# Altium schematic sheet llrf_fmc_ext_male.SchDoc: =GlobalProjectName
size 410 x 297 mm; SheetNumber: 1; SheetTotal: 1; PageSetup: Record=PageOptions|CenterHorizontal=True|CenterVertical=True|PrintScale=1.00|XCorrection=1.00|YCorrection=1.00|PrintKind=1|BorderSize=5000000|LeftOffset=0|BottomOffset=0|Orientation=2|PaperLength=1000|PaperWidth=1000|Scale=100|PaperSource=15|PrintQuality=1200|MediaType=1|DitherType=10|PaperKind=A3|PrintScaleMode=1; Weight: -; ScaleFactor: -
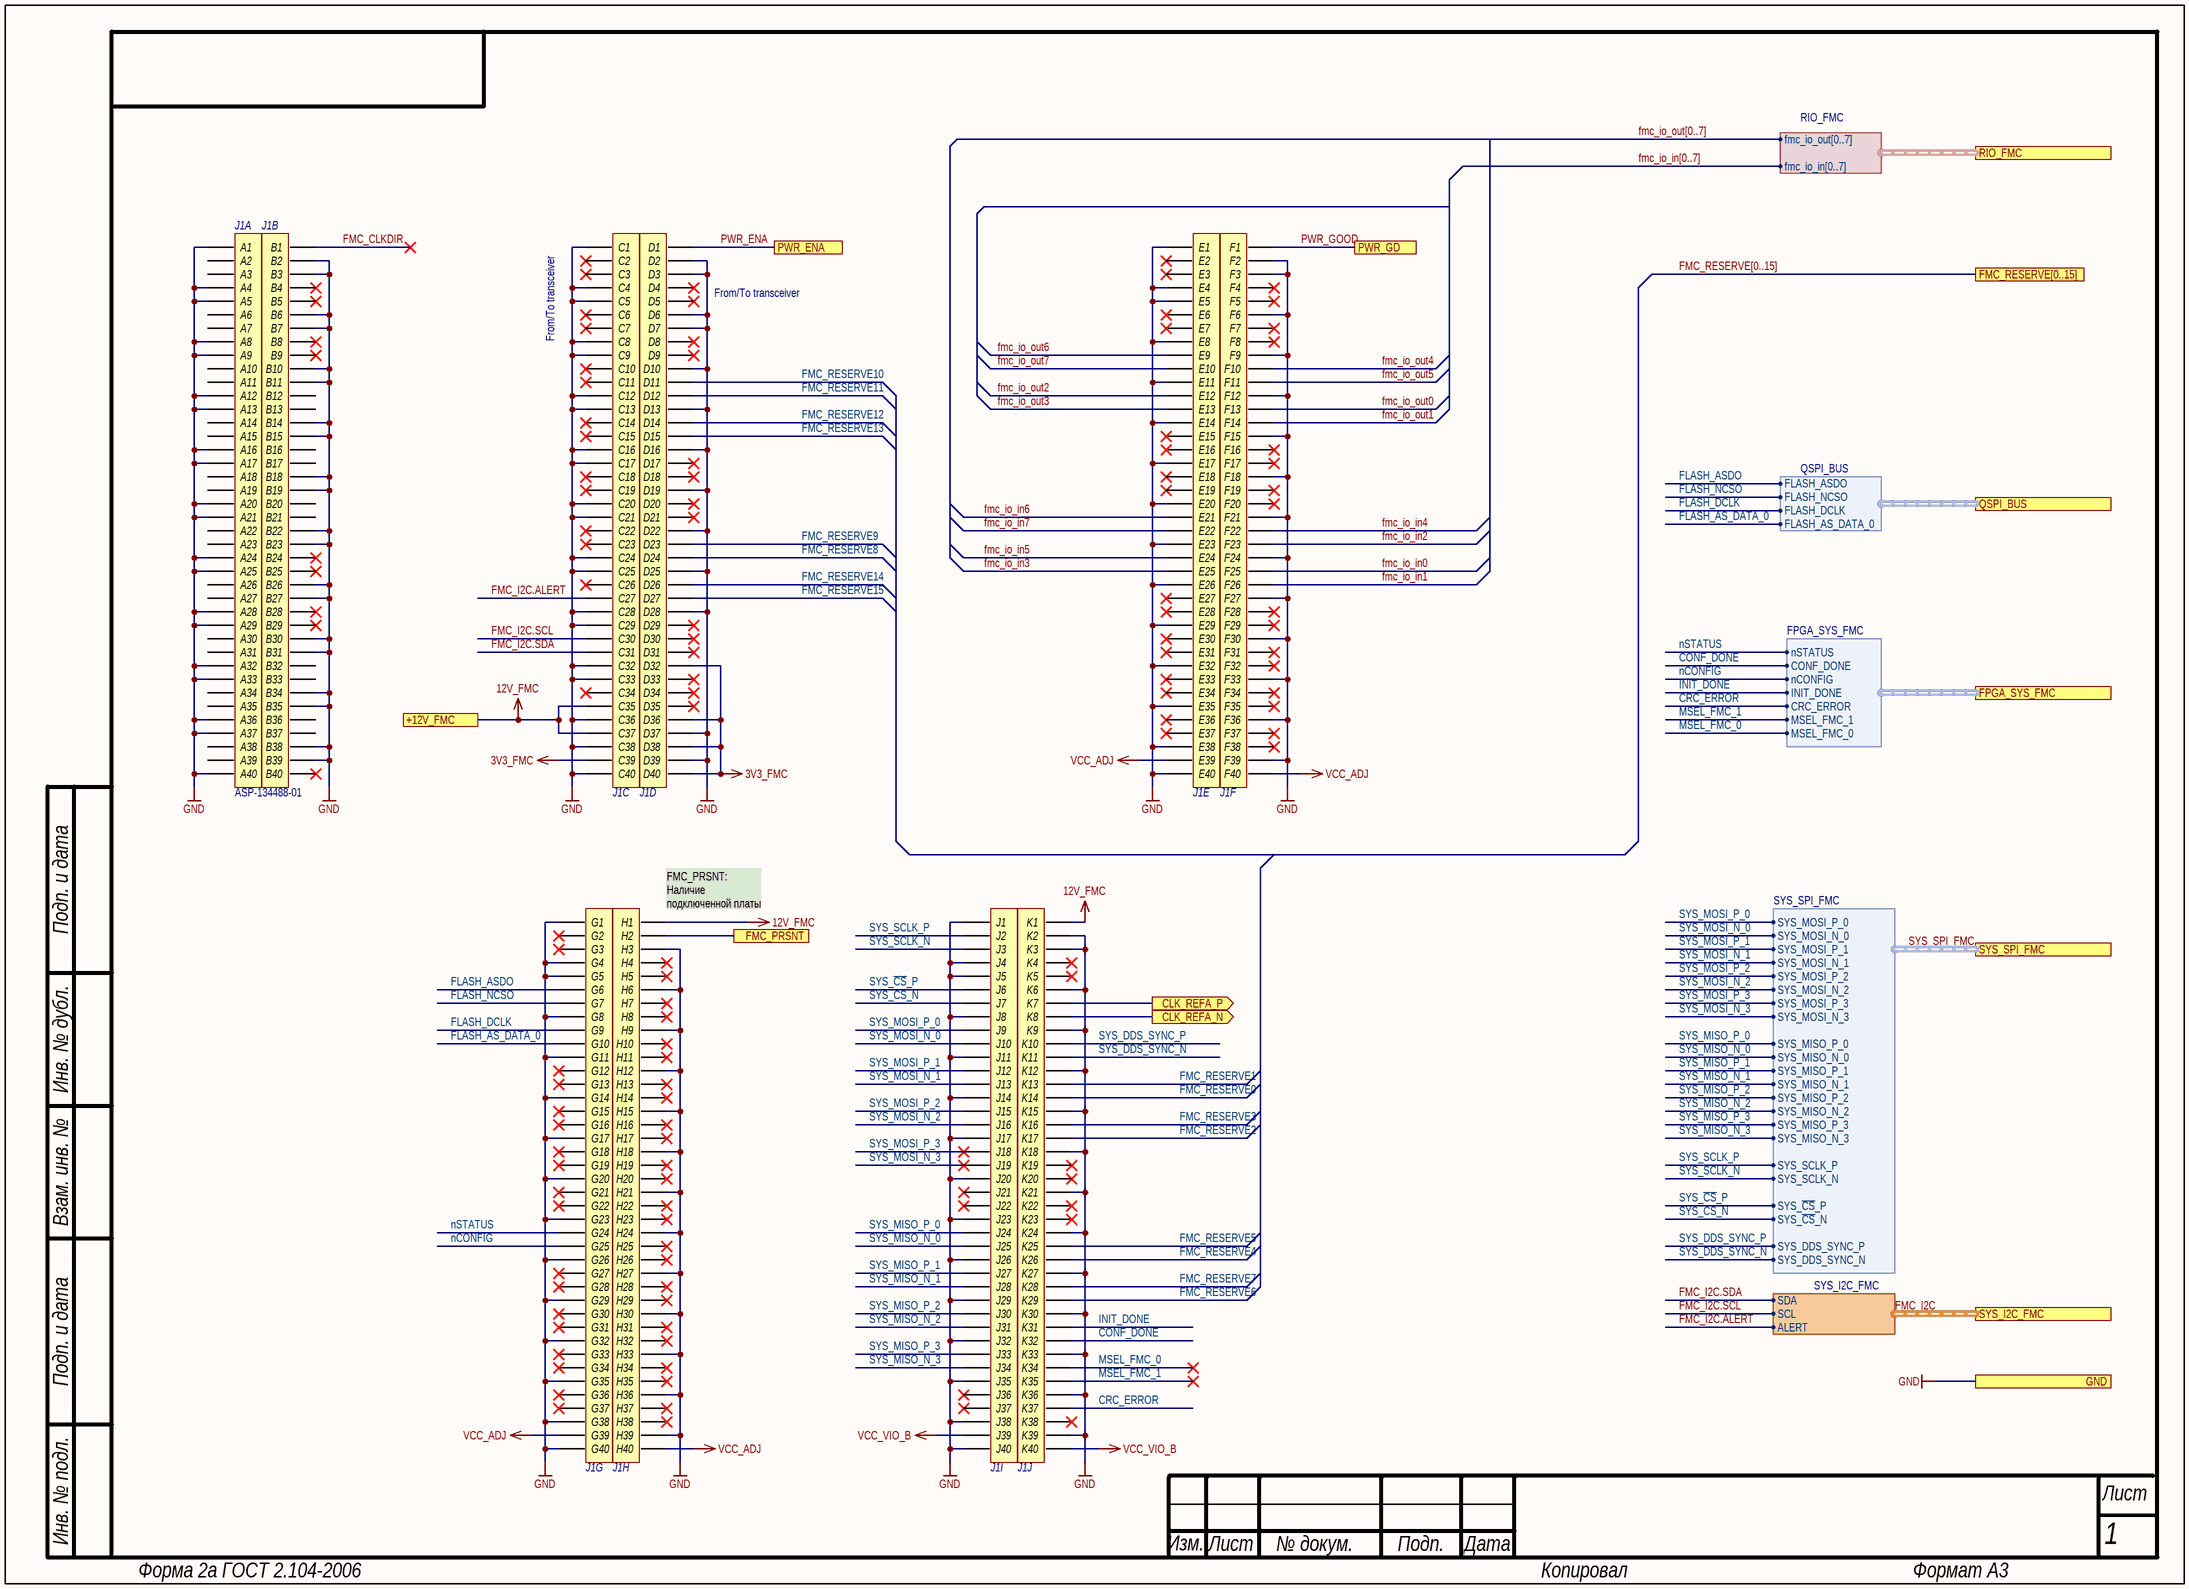
[diagram p0: llrf_fmc_ext_male.SchDoc]

## Parts
J1  ASP-134488-01  [ASP-134488-01]  (parts A,B,C,D,E,F,G,H,I,J of 10)

## Ports
+12V_FMC, CLK_REFA_N (out), CLK_REFA_P (out), FMC_PRSNT, FMC_RESERVE[0..15], FPGA_SYS_FMC (harness FPGA_SYS_FMC), GND, PWR_ENA, PWR_GD, QSPI_BUS (harness QSPI_BUS), RIO_FMC (harness RIO_FMC), SYS_I2C_FMC (harness SYS_I2C_FMC), SYS_SPI_FMC (harness SYS_SPI_FMC)

## Harnesses
RIO_FMC: fmc_io_out[0..7], fmc_io_in[0..7]
SYS_I2C_FMC: SDA, SCL, ALERT
SYS_SPI_FMC: SYS_MOSI_P_0, SYS_SCLK_P, SYS_~{CS}_P, SYS_MOSI_P_1, SYS_MOSI_P_2, SYS_MOSI_P_3, SYS_MOSI_N_0, SYS_MOSI_N_1, SYS_MOSI_N_2, SYS_MOSI_N_3, SYS_MISO_P_0, SYS_MISO_P_1, SYS_MISO_P_2, SYS_MISO_P_3, SYS_MISO_N_0, SYS_MISO_N_1, SYS_MISO_N_2, SYS_MISO_N_3, SYS_SCLK_N, SYS_DDS_SYNC_P, SYS_~{CS}_N, SYS_DDS_SYNC_N
QSPI_BUS: FLASH_ASDO, FLASH_NCSO, FLASH_DCLK, FLASH_AS_DATA_0
FPGA_SYS_FMC: INIT_DONE, nSTATUS, CONF_DONE, nCONFIG, MSEL_FMC_0, MSEL_FMC_1, CRC_ERROR

## Nets
3V3_FMC: J1.C39 J1.D32 J1.D36 J1.D38 J1.D40
12V_FMC: J1.C35 J1.C37 J1.H1 J1.K1 ; port +12V_FMC
GND: J1.A1 J1.A4 J1.A5 J1.A8 J1.A9 J1.A12 J1.A13 J1.A16 J1.A17 J1.A20 J1.A21 J1.A24 J1.A25 J1.A28 J1.A29 J1.A32 J1.A33 J1.A36 J1.A37 J1.A40 J1.B2 J1.B3 J1.B6 J1.B7 J1.B10 J1.B11 J1.B14 J1.B15 J1.B18 J1.B19 J1.B22 J1.B23 J1.B26 J1.B27 J1.B30 J1.B31 J1.B34 J1.B35 J1.B38 J1.B39 J1.C1 J1.C4 J1.C5 J1.C8 J1.C9 J1.C12 J1.C13 J1.C16 J1.C17 J1.C20 J1.C21 J1.C24 J1.C25 J1.C28 J1.C29 J1.C32 J1.C33 J1.C36 J1.C38 J1.C40 J1.D2 J1.D3 J1.D6 J1.D7 J1.D10 J1.D13 J1.D16 J1.D19 J1.D22 J1.D25 J1.D28 J1.D37 J1.D39 J1.E1 J1.E4 J1.E5 J1.E8 J1.E11 J1.E14 J1.E17 J1.E20 J1.E23 J1.E26 J1.E29 J1.E32 J1.E35 J1.E38 J1.E40 J1.F2 J1.F3 J1.F6 J1.F9 J1.F12 J1.F15 J1.F18 J1.F21 J1.F24 J1.F27 J1.F30 J1.F33 J1.F36 J1.F39 J1.G1 J1.G4 J1.G5 J1.G8 J1.G11 J1.G14 J1.G17 J1.G20 J1.G23 J1.G26 J1.G29 J1.G32 J1.G35 J1.G38 J1.G40 J1.H3 J1.H6 J1.H9 J1.H12 J1.H15 J1.H18 J1.H21 J1.H24 J1.H27 J1.H30 J1.H33 J1.H36 J1.H39 J1.J1 J1.J4 J1.J5 J1.J8 J1.J11 J1.J14 J1.J17 J1.J20 J1.J23 J1.J26 J1.J29 J1.J32 J1.J35 J1.J38 J1.J40 J1.K2 J1.K3 J1.K6 J1.K9 J1.K12 J1.K15 J1.K18 J1.K21 J1.K24 J1.K27 J1.K30 J1.K33 J1.K36 J1.K39 ; port GND
VCC_ADJ: J1.E39 J1.F40 J1.G39 J1.H40
VCC_VIO_B: J1.J39 J1.K40
CLK_REFA_N: J1.K8 ; port CLK_REFA_N
CLK_REFA_P: J1.K7 ; port CLK_REFA_P
CONF_DONE: J1.K32 ; port FPGA_SYS_FMC.CONF_DONE
CRC_ERROR: J1.K37 ; port FPGA_SYS_FMC.CRC_ERROR
FLASH_AS_DATA_0: J1.G10 ; port QSPI_BUS.FLASH_AS_DATA_0
FLASH_ASDO: J1.G6 ; port QSPI_BUS.FLASH_ASDO
FLASH_DCLK: J1.G9 ; port QSPI_BUS.FLASH_DCLK
FLASH_NCSO: J1.G7 ; port QSPI_BUS.FLASH_NCSO
FMC_CLKDIR: J1.B1
FMC_I2C.ALERT: J1.C27 ; port SYS_I2C_FMC.ALERT
FMC_I2C.SCL: J1.C30 ; port SYS_I2C_FMC.SCL
FMC_I2C.SDA: J1.C31 ; port SYS_I2C_FMC.SDA
fmc_io_in0: J1.F25
fmc_io_in1: J1.F26
fmc_io_in2: J1.F23
fmc_io_in3: J1.E25
fmc_io_in4: J1.F22
fmc_io_in5: J1.E24
fmc_io_in6: J1.E21
fmc_io_in7: J1.E22
fmc_io_out0: J1.F13
fmc_io_out1: J1.F14
fmc_io_out2: J1.E12
fmc_io_out3: J1.E13
fmc_io_out4: J1.F10
fmc_io_out5: J1.F11
fmc_io_out6: J1.E9
fmc_io_out7: J1.E10
FMC_PRSNT: J1.H2 ; port FMC_PRSNT
FMC_RESERVE0: J1.K14
FMC_RESERVE1: J1.K13
FMC_RESERVE2: J1.K17
FMC_RESERVE3: J1.K16
FMC_RESERVE4: J1.K26
FMC_RESERVE5: J1.K25
FMC_RESERVE6: J1.K29
FMC_RESERVE7: J1.K28
FMC_RESERVE8: J1.D24
FMC_RESERVE9: J1.D23
FMC_RESERVE10: J1.D11
FMC_RESERVE11: J1.D12
FMC_RESERVE12: J1.D14
FMC_RESERVE13: J1.D15
FMC_RESERVE14: J1.D26
FMC_RESERVE15: J1.D27
INIT_DONE: J1.K31 ; port FPGA_SYS_FMC.INIT_DONE
MSEL_FMC_0: J1.K34 ; port FPGA_SYS_FMC.MSEL_FMC_0
MSEL_FMC_1: J1.K35 ; port FPGA_SYS_FMC.MSEL_FMC_1
nCONFIG: J1.G25 ; port FPGA_SYS_FMC.nCONFIG
nSTATUS: J1.G24 ; port FPGA_SYS_FMC.nSTATUS
PWR_ENA: J1.D1 ; port PWR_ENA
PWR_GOOD: J1.F1 ; port PWR_GD
SYS_~{CS}_N: J1.J7 ; port SYS_SPI_FMC.SYS_~{CS}_N
SYS_~{CS}_P: J1.J6 ; port SYS_SPI_FMC.SYS_~{CS}_P
SYS_DDS_SYNC_N: J1.K11 ; port SYS_SPI_FMC.SYS_DDS_SYNC_N
SYS_DDS_SYNC_P: J1.K10 ; port SYS_SPI_FMC.SYS_DDS_SYNC_P
SYS_MISO_N_0: J1.J25 ; port SYS_SPI_FMC.SYS_MISO_N_0
SYS_MISO_N_1: J1.J28 ; port SYS_SPI_FMC.SYS_MISO_N_1
SYS_MISO_N_2: J1.J31 ; port SYS_SPI_FMC.SYS_MISO_N_2
SYS_MISO_N_3: J1.J34 ; port SYS_SPI_FMC.SYS_MISO_N_3
SYS_MISO_P_0: J1.J24 ; port SYS_SPI_FMC.SYS_MISO_P_0
SYS_MISO_P_1: J1.J27 ; port SYS_SPI_FMC.SYS_MISO_P_1
SYS_MISO_P_2: J1.J30 ; port SYS_SPI_FMC.SYS_MISO_P_2
SYS_MISO_P_3: J1.J33 ; port SYS_SPI_FMC.SYS_MISO_P_3
SYS_MOSI_N_0: J1.J10 ; port SYS_SPI_FMC.SYS_MOSI_N_0
SYS_MOSI_N_1: J1.J13 ; port SYS_SPI_FMC.SYS_MOSI_N_1
SYS_MOSI_N_2: J1.J16 ; port SYS_SPI_FMC.SYS_MOSI_N_2
SYS_MOSI_N_3: J1.J19 ; port SYS_SPI_FMC.SYS_MOSI_N_3
SYS_MOSI_P_0: J1.J9 ; port SYS_SPI_FMC.SYS_MOSI_P_0
SYS_MOSI_P_1: J1.J12 ; port SYS_SPI_FMC.SYS_MOSI_P_1
SYS_MOSI_P_2: J1.J15 ; port SYS_SPI_FMC.SYS_MOSI_P_2
SYS_MOSI_P_3: J1.J18 ; port SYS_SPI_FMC.SYS_MOSI_P_3
SYS_SCLK_N: J1.J3 ; port SYS_SPI_FMC.SYS_SCLK_N
SYS_SCLK_P: J1.J2 ; port SYS_SPI_FMC.SYS_SCLK_P

Not connected (* = marked no-connect by the designer): J1 A2 A3 A6 A7 A10 A11 A14 A15 A18 A19 A22 A23 A26 A27 A30 A31 A34 A35 A38 A39 B4* B5* B8* B9* B12 B13 B16 B17 B20 B21 B24* B25* B28* B29* B32 B33 B36 B37 B40* C2* C3* C6* C7* C10* C11* C14* C15* C18* C19* C22* C23* C26* C34* D4* D5* D8* D9* D17* D18* D20* D21* D29* D30* D31* D33* D34* D35* E2* E3* E6* E7* E15* E16* E18* E19* E27* E28* E30* E31* E33* E34* E36* E37* F4* F5* F7* F8* F16* F17* F19* F20* F28* F29* F31* F32* F34* F35* F37* F38* G2* G3* G12* G13* G15* G16* G18* G19* G21* G22* G27* G28* G30* G31* G33* G34* G36* G37* H4* H5* H7* H8* H10* H11* H13* H14* H16* H17* H19* H20* H22* H23* H25* H26* H28* H29* H31* H32* H34* H35* H37* H38* J21* J22* J36* J37* K4* K5* K19* K20* K22* K23* K38*

## Buses and harness runs
bus fmc_io_in[0..7]
bus fmc_io_out[0..7]
bus FMC_RESERVE[0..15] = port FMC_RESERVE[0..15]
harness FMC_I2C = port SYS_I2C_FMC
harness SYS_SPI_FMC = port SYS_SPI_FMC

## Notes on the sheet
- (near J1) From/To transceiver
- (near J1) FMC_PRSNT:
  Наличие подключенной платы
- Подп. и дата
- Инв. № дубл.
- Взам. инв. №
- Инв. № подл.
- Изм.
- Лист
- № докум.
- Подп.
- Дата
- Форма 2а ГОСТ 2.104-2006
- Копировал
- Формат А3

## Library data of the parts
J1 = ASP-134488-01: Socket Array Assembly, Surface Mount, 0.050" Pitch, 400 Pins; MANUFACTURER: SAMTEC; PCB DECAL: SEAF-40-XX.X-XX-10-X-A; Потребление, Вт: 0,0; Назначение: FMC HPC socket Array Assembly, Surface Mount, 0.050" Pitch, 400 Pins; CREATED: March 24, 2015 - Wendy Xin; ComponentLink1Description: DataSheet; ComponentLink1URL: https://suddendocs.samtec.com/prints/asp-134488-01-mkt.pdf; Supplier 1: Digi-Key; Supplier Part Number 1: SAM8730-ND; Наименование: ASP-134488-01